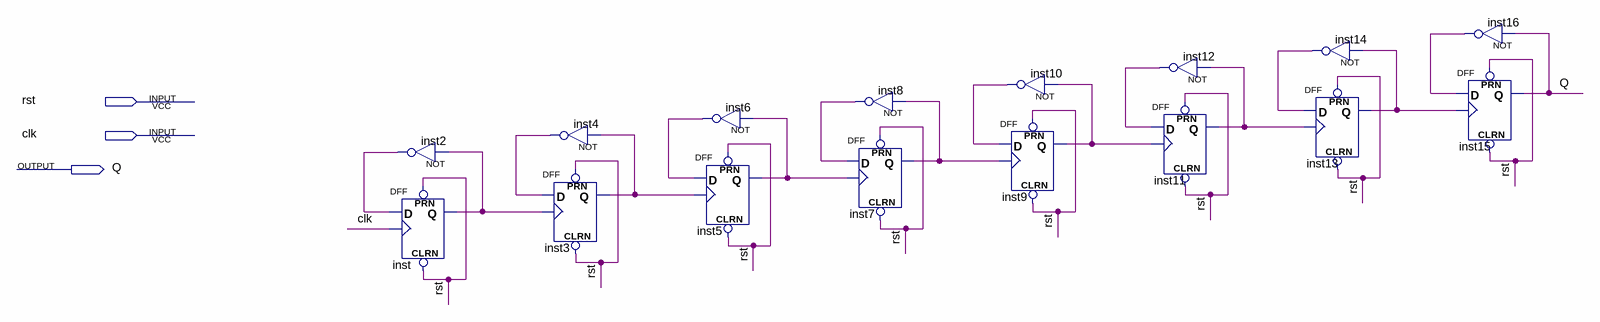
[diagram p0: schematic sheet]
// Quartus schematic lab07.bdf as structural Verilog: 16 symbols, 3 pins
module lab07 (
  input  rst,
  input  clk,
  output Q
);

  wire inst2_out, inst3_q, inst4_out, inst5_q, inst6_out, inst7_q, inst8_out, inst9_q, inst10_out, inst11_q,
       inst12_out, inst13_q, inst14_out, inst16_out, inst_q;

  not inst2 (inst2_out, inst_q);
  DFF inst (.CLRN(rst), .CLK(clk), .D(inst2_out), .PRN(rst), .Q(inst_q));
  not inst4 (inst4_out, inst3_q);
  DFF inst3 (.CLRN(rst), .CLK(inst_q), .D(inst4_out), .PRN(rst), .Q(inst3_q));
  not inst6 (inst6_out, inst5_q);
  DFF inst5 (.CLRN(rst), .CLK(inst3_q), .D(inst6_out), .PRN(rst), .Q(inst5_q));
  not inst8 (inst8_out, inst7_q);
  DFF inst7 (.CLRN(rst), .CLK(inst5_q), .D(inst8_out), .PRN(rst), .Q(inst7_q));
  not inst10 (inst10_out, inst9_q);
  DFF inst9 (.CLRN(rst), .CLK(inst7_q), .D(inst10_out), .PRN(rst), .Q(inst9_q));
  not inst12 (inst12_out, inst11_q);
  DFF inst11 (.CLRN(rst), .CLK(inst9_q), .D(inst12_out), .PRN(rst), .Q(inst11_q));
  not inst14 (inst14_out, inst13_q);
  DFF inst13 (.CLRN(rst), .CLK(inst11_q), .D(inst14_out), .PRN(rst), .Q(inst13_q));
  not inst16 (inst16_out, Q);
  DFF inst15 (.CLRN(rst), .CLK(inst13_q), .D(inst16_out), .PRN(rst), .Q(Q));
endmodule
